# EAGLE schematic pic32_sub_module (EAGLE 7.6.0)
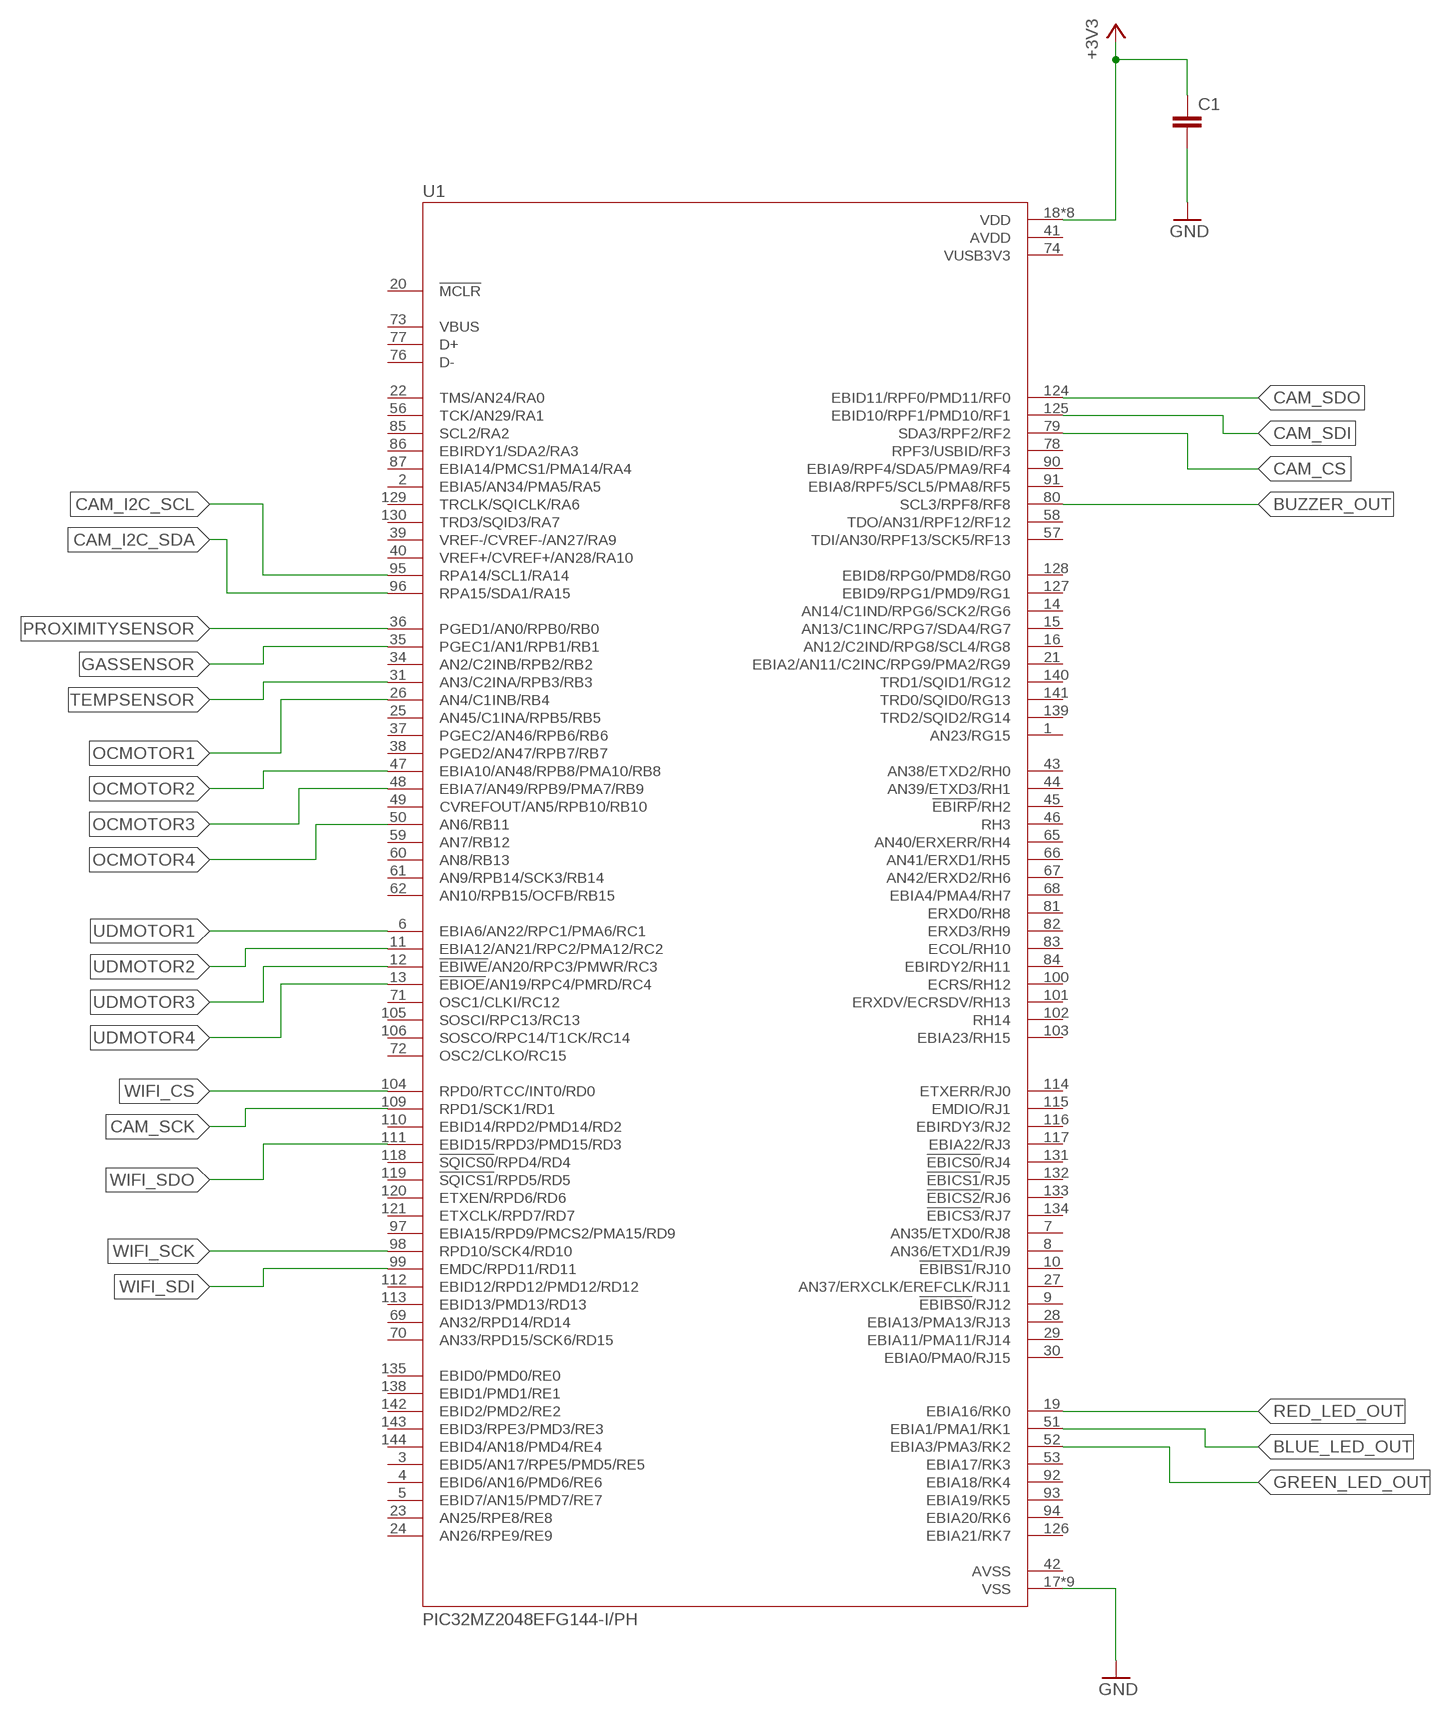
[diagram p0: schematic, sheet 1]

## Parts
C1  C-EU025-024X044  [C025-024X044]
U1  PIC32MZ2048EFG144-I/PH  [QFP40P1800X1800X120-144N]

## Nets
+3V3: C1.1 U1.18(VDD) U1.33(VDD) U1.55(VDD) U1.64(VDD) U1.88(VDD) U1.107(VDD) U1.122(VDD) U1.137(VDD)
BLUE_LED_OUT: U1.51(EBIA1/PMA1/RK1)
BUZZER_OUT: U1.80(SCL3/RPF8/RF8)
CAM_CS: U1.79(SDA3/RPF2/RF2)
CAM_I2C_SCL: U1.95(RPA14/SCL1/RA14)
CAM_I2C_SDA: U1.96(RPA15/SDA1/RA15)
CAM_SCK: U1.109(RPD1/SCK1/RD1)
CAM_SDI: U1.125(EBID10/RPF1/PMD10/RF1)
CAM_SDO: U1.124(EBID11/RPF0/PMD11/RF0)
GASSENSOR: U1.35(PGEC1/AN1/RPB1/RB1)
GND: C1.2 U1.17(VSS) U1.32(VSS) U1.54(VSS) U1.63(VSS) U1.75(VSS) U1.89(VSS) U1.108(VSS) U1.123(VSS) U1.136(VSS)
GREEN_LED_OUT: U1.52(EBIA3/PMA3/RK2)
OCMOTOR1: U1.26(AN4/C1INB/RB4)
OCMOTOR2: U1.47(EBIA10/AN48/RPB8/PMA10/RB8)
OCMOTOR3: U1.48(EBIA7/AN49/RPB9/PMA7/RB9)
OCMOTOR4: U1.50(AN6/RB11)
PROXIMITYSENSOR: U1.36(PGED1/AN0/RPB0/RB0)
RED_LED_OUT: U1.19(EBIA16/RK0)
TEMPSENSOR: U1.31(AN3/C2INA/RPB3/RB3)
UDMOTOR1: U1.6(EBIA6/AN22/RPC1/PMA6/RC1)
UDMOTOR2: U1.11(EBIA12/AN21/RPC2/PMA12/RC2)
UDMOTOR3: U1.12(!EBIWE!/AN20/RPC3/PMWR/RC3)
UDMOTOR4: U1.13(!EBIOE!/AN19/RPC4/PMRD/RC4)
WIFI_CS: U1.104(RPD0/RTCC/INT0/RD0)
WIFI_SCK: U1.98(RPD10/SCK4/RD10)
WIFI_SDI: U1.99(EMDC/RPD11/RD11)
WIFI_SDO: U1.111(EBID15/RPD3/PMD15/RD3)
Unconnected: U1.1(AN23/RG15) U1.2(EBIA5/AN34/PMA5/RA5) U1.3(EBID5/AN17/RPE5/PMD5/RE5) U1.4(EBID6/AN16/PMD6/RE6) U1.5(EBID7/AN15/PMD7/RE7) U1.7(AN35/ETXD0/RJ8) U1.8(AN36/ETXD1/RJ9) U1.9(!EBIBS0!/RJ12) U1.10(!EBIBS1!/RJ10) U1.14(AN14/C1IND/RPG6/SCK2/RG6) U1.15(AN13/C1INC/RPG7/SDA4/RG7) U1.16(AN12/C2IND/RPG8/SCL4/RG8) U1.20(!MCLR) U1.21(EBIA2/AN11/C2INC/RPG9/PMA2/RG9) U1.22(TMS/AN24/RA0) U1.23(AN25/RPE8/RE8) U1.24(AN26/RPE9/RE9) U1.25(AN45/C1INA/RPB5/RB5) U1.27(AN37/ERXCLK/EREFCLK/RJ11) U1.28(EBIA13/PMA13/RJ13) U1.29(EBIA11/PMA11/RJ14) U1.30(EBIA0/PMA0/RJ15) U1.34(AN2/C2INB/RPB2/RB2) U1.37(PGEC2/AN46/RPB6/RB6) U1.38(PGED2/AN47/RPB7/RB7) U1.39(VREF-/CVREF-/AN27/RA9) U1.40(VREF+/CVREF+/AN28/RA10) U1.43(AN38/ETXD2/RH0) U1.44(AN39/ETXD3/RH1) U1.45(!EBIRP!/RH2) U1.46(RH3) U1.49(CVREFOUT/AN5/RPB10/RB10) U1.53(EBIA17/RK3) U1.56(TCK/AN29/RA1) U1.57(TDI/AN30/RPF13/SCK5/RF13) U1.58(TDO/AN31/RPF12/RF12) U1.59(AN7/RB12) U1.60(AN8/RB13) U1.61(AN9/RPB14/SCK3/RB14) U1.62(AN10/RPB15/OCFB/RB15) U1.65(AN40/ERXERR/RH4) U1.66(AN41/ERXD1/RH5) U1.67(AN42/ERXD2/RH6) U1.68(EBIA4/PMA4/RH7) U1.69(AN32/RPD14/RD14) U1.70(AN33/RPD15/SCK6/RD15) U1.71(OSC1/CLKI/RC12) U1.72(OSC2/CLKO/RC15) U1.73(VBUS) U1.76(D-) U1.77(D+) U1.78(RPF3/USBID/RF3) U1.81(ERXD0/RH8) U1.82(ERXD3/RH9) U1.83(ECOL/RH10) U1.84(EBIRDY2/RH11) U1.85(SCL2/RA2) U1.86(EBIRDY1/SDA2/RA3) U1.87(EBIA14/PMCS1/PMA14/RA4) U1.90(EBIA9/RPF4/SDA5/PMA9/RF4) U1.91(EBIA8/RPF5/SCL5/PMA8/RF5) U1.92(EBIA18/RK4) U1.93(EBIA19/RK5) U1.94(EBIA20/RK6) U1.97(EBIA15/RPD9/PMCS2/PMA15/RD9) U1.100(ECRS/RH12) U1.101(ERXDV/ECRSDV/RH13) U1.102(RH14) U1.103(EBIA23/RH15) U1.105(SOSCI/RPC13/RC13) U1.106(SOSCO/RPC14/T1CK/RC14) U1.110(EBID14/RPD2/PMD14/RD2) U1.112(EBID12/RPD12/PMD12/RD12) U1.113(EBID13/PMD13/RD13) U1.114(ETXERR/RJ0) U1.115(EMDIO/RJ1) U1.116(EBIRDY3/RJ2) U1.117(EBIA22/RJ3) U1.118(!SQICS0!/RPD4/RD4) U1.119(!SQICS1!/RPD5/RD5) U1.120(ETXEN/RPD6/RD6) U1.121(ETXCLK/RPD7/RD7) U1.126(EBIA21/RK7) U1.127(EBID9/RPG1/PMD9/RG1) U1.128(EBID8/RPG0/PMD8/RG0) U1.129(TRCLK/SQICLK/RA6) U1.130(TRD3/SQID3/RA7) U1.131(!EBICS0!/RJ4) U1.132(!EBICS1!/RJ5) U1.133(!EBICS2!/RJ6) U1.134(!EBICS3!/RJ7) U1.135(EBID0/PMD0/RE0) U1.138(EBID1/PMD1/RE1) U1.139(TRD2/SQID2/RG14) U1.140(TRD1/SQID1/RG12) U1.141(TRD0/SQID0/RG13) U1.142(EBID2/PMD2/RE2) U1.143(EBID3/RPE3/PMD3/RE3) U1.144(EBID4/AN18/PMD4/RE4)

## Power pins joined to a net without a drawn wire
AVDD: U1.41(AVDD)
AVSS: U1.42(AVSS)
VUSB3V3: U1.74(VUSB3V3)

## Library data of the parts
C1 = rcl:C-EU: CAPACITOR, European symbol
U1 = PIC32MZ2048EFG144-I_PH:PIC32MZ2048EFG144-I/PH: MCU 32-Bit PIC32MZEF PIC RISC 2MB Flash 2.5V/3.3V 144-Pin TQFP Tray; AVAILABILITY: Unavailable; DESCRIPTION: MCU 32-Bit PIC32MZEF PIC RISC 2MB Flash 2.5V/3.3V 144-Pin TQFP Tray; MF: Microchip; MP: PIC32MZ2048EFG144-I/PH; PACKAGE: TQFP-144 Microchip; PRICE: None